# Altium schematic sheet TOP_VOLTAGE.SchDoc
size A3
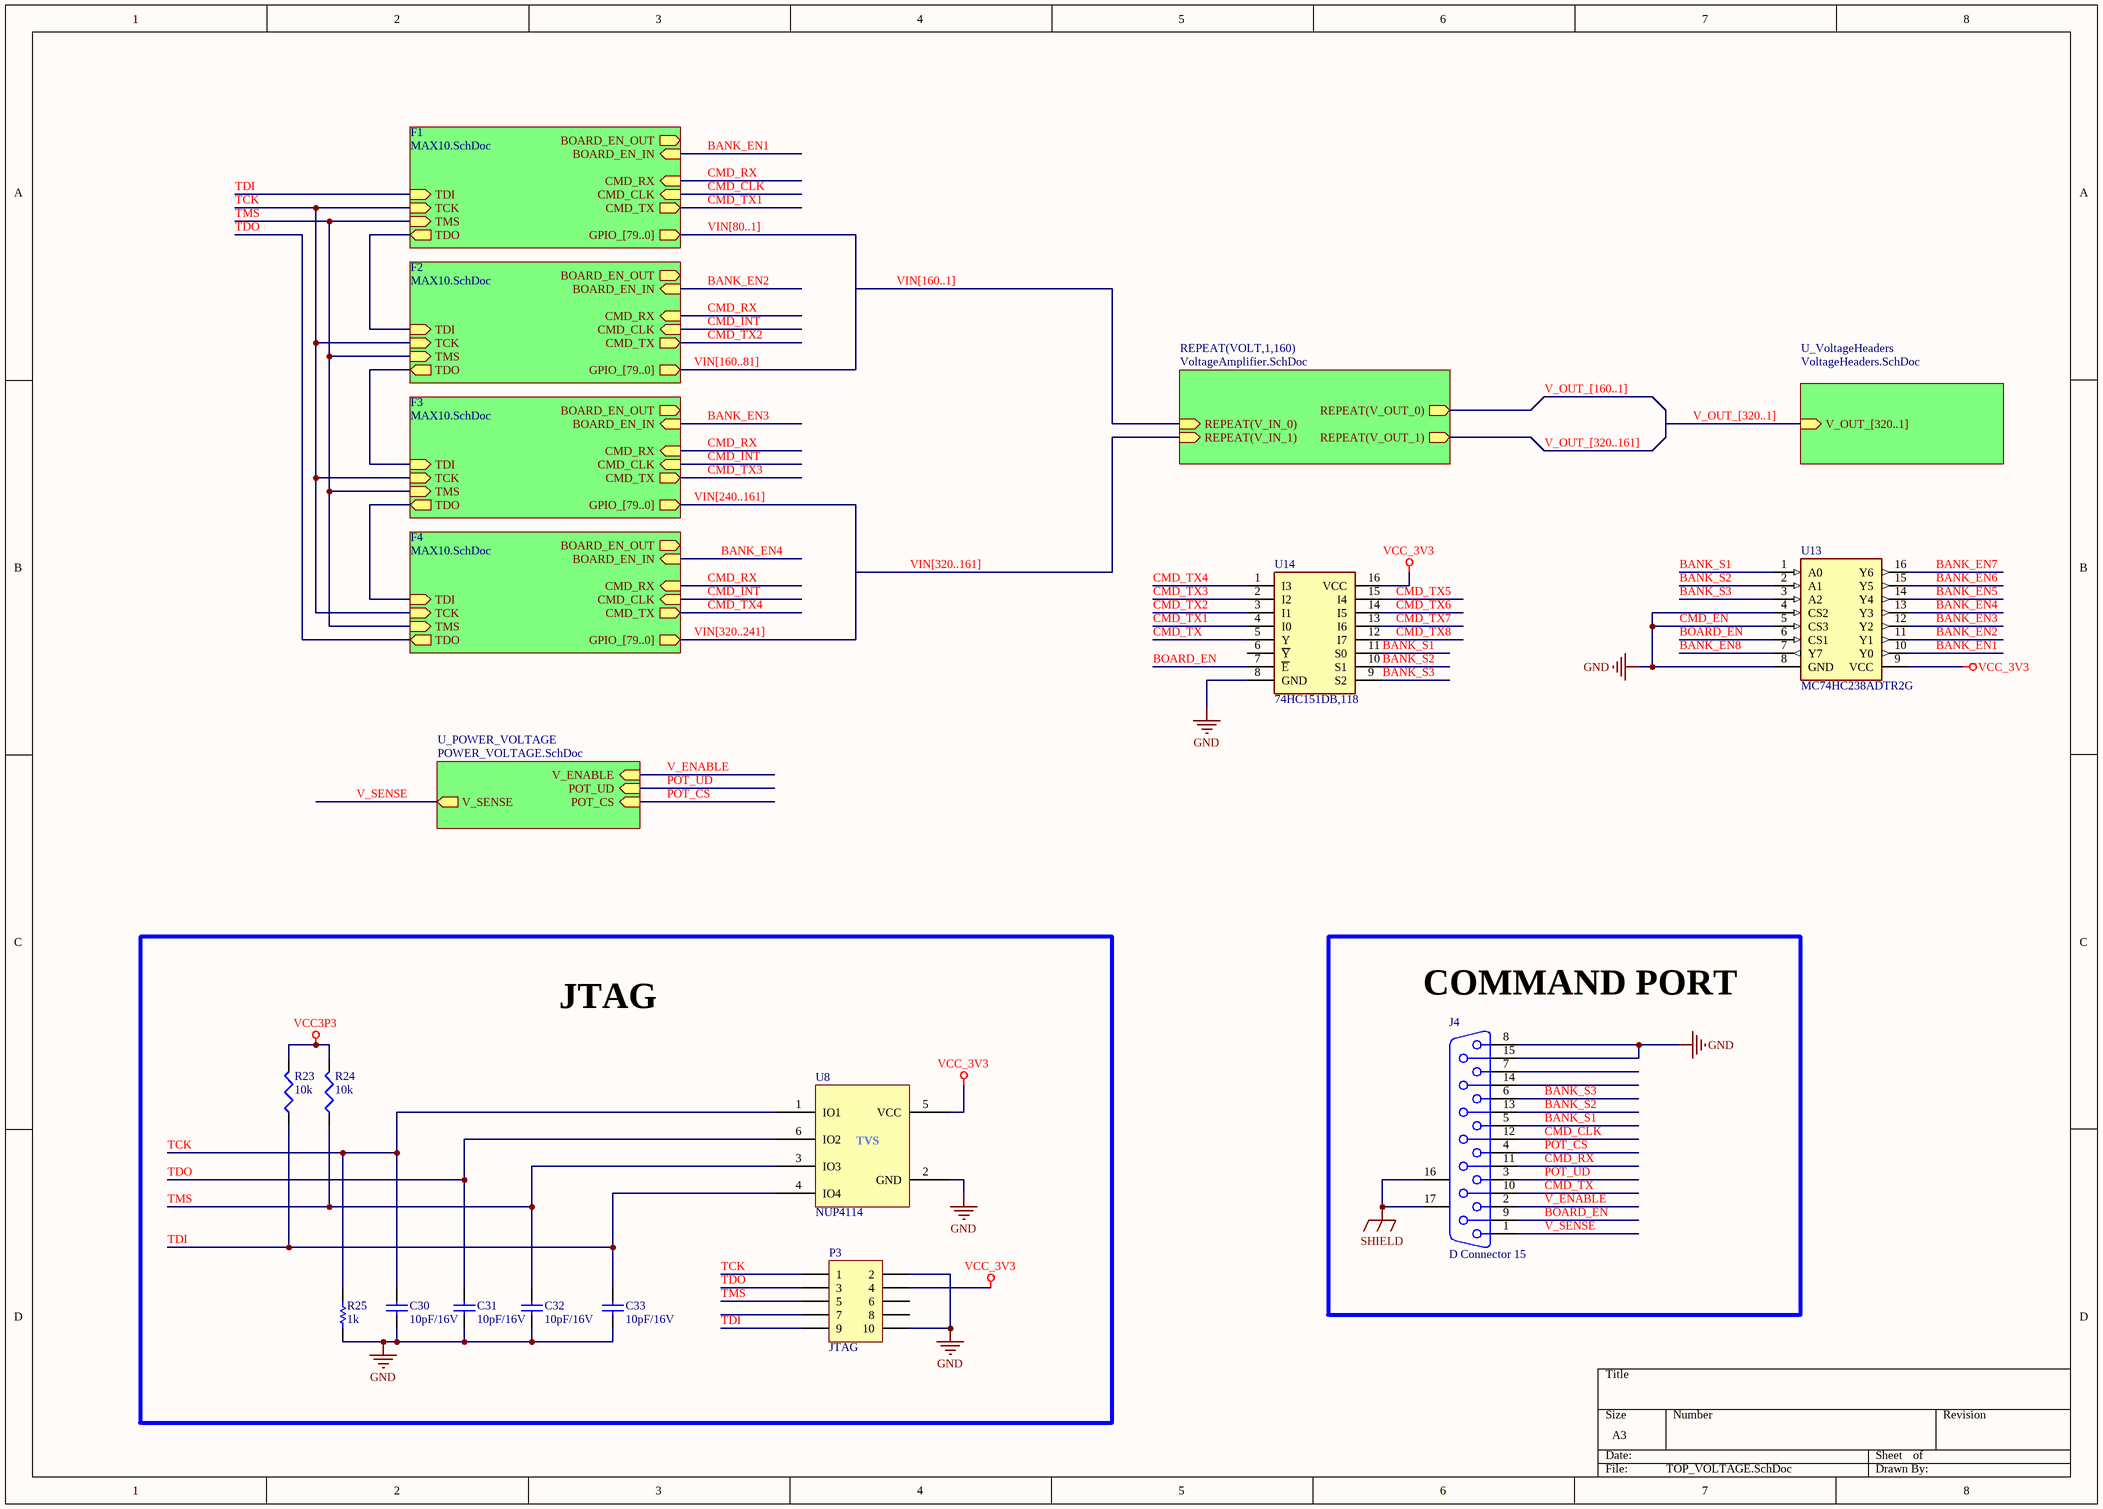
[diagram p0: TOP_VOLTAGE.SchDoc]

## Parts
C30  10pF/16V  [0603_CAP]
C31  10pF/16V  [0603_CAP]
C32  10pF/16V  [0603_CAP]
C33  10pF/16V  [0603_CAP]
J4  D Connector 15  [DSUB1.385-2H15]
P3  JTAG  [HDR2X5]
R23  10k  [0402_RES]
R24  10k  [0402_RES]
R25  1k  [RES_0805]
U8  NUP4114  [NUP4114HMR6T1G]
U13  MC74HC238ADTR2G  [SOP65P640X120-16N]
U14  74HC151DB,118  [SOP65P775X200-16N]

## Blocks framed on the sheet
JTAG: C30-C33 P3 R23-R25 U8
COMMAND PORT: J4

## Sub-sheets
F1 = MAX10.SchDoc: TDI (in), GPIO_[79..0] (out), TCK (in), TMS (in), TDO (out), CMD_RX (in), CMD_TX (out), BOARD_EN_IN (in), BOARD_EN_OUT (out), CMD_CLK (in)
F2 = MAX10.SchDoc: TDI (in), GPIO_[79..0] (out), TCK (in), TMS (in), TDO (out), CMD_TX (out), CMD_RX (in), BOARD_EN_OUT (out), BOARD_EN_IN (in), CMD_CLK (in)
F3 = MAX10.SchDoc: TDI (in), GPIO_[79..0] (out), TCK (in), TMS (in), TDO (out), CMD_TX (out), CMD_RX (in), CMD_CLK (in), BOARD_EN_IN (in), BOARD_EN_OUT (out)
F4 = MAX10.SchDoc: TDI (in), GPIO_[79..0] (out), TCK (in), TMS (in), TDO (out), CMD_TX (out), CMD_RX (in), BOARD_EN_IN (in), CMD_CLK (in), BOARD_EN_OUT (out)
REPEAT(VOLT,1,160) = VoltageAmplifier.SchDoc: REPEAT(V_IN_0) (in), REPEAT(V_OUT_0) (out), REPEAT(V_OUT_1) (out), REPEAT(V_IN_1) (in)
U_POWER_VOLTAGE = POWER_VOLTAGE.SchDoc: V_SENSE (out), V_ENABLE (in), POT_UD (in), POT_CS (in)
U_VoltageHeaders = VoltageHeaders.SchDoc: V_OUT_[320..1] (in)

## Nets
CMD_EN: C30.1 C31.1 C32.1 C33.1 J4.8 J4.15 P3.2 P3.10 R25.2 U8.2(GND) U13.4(CS2) U13.5(CS3) U13.8(GND) U14.8(GND)  [also labelled GND]
SHIELD: J4.16(MH1) J4.17(MH2)
VCC3P3: R23.2 R24.2
VCC_3V3: P3.4 U8.5(VCC) U13.9(VCC) U14.16(VCC)
BANK_EN1: U13.10(Y0) ; sheet F1/BOARD_EN_IN
BANK_EN2: U13.11(Y1) ; sheet F2/BOARD_EN_IN
BANK_EN3: U13.12(Y2) ; sheet F3/BOARD_EN_IN
BANK_EN4: U13.13(Y3) ; sheet F4/BOARD_EN_IN
BANK_EN5: U13.14(Y4)
BANK_EN6: U13.15(Y5)
BANK_EN7: U13.16(Y6)
BANK_EN8: U13.7(Y7)
BANK_S1: J4.5 U13.1(A0) U14.11(S0)
BANK_S2: J4.13 U13.2(A1) U14.10(S1)
BANK_S3: J4.6 U13.3(A2) U14.9(S2)
BOARD_EN: J4.9 U13.6(CS1) U14.7(~{E})
CMD_CLK: J4.12 ; sheet F1/CMD_CLK
CMD_INT: sheet F2/CMD_CLK, sheet F3/CMD_CLK, sheet F4/CMD_CLK
CMD_RX: J4.11 ; sheet F1/CMD_RX, sheet F2/CMD_RX, sheet F3/CMD_RX, sheet F4/CMD_RX
CMD_TX: J4.10 U14.5(Y)
CMD_TX1: U14.4(I0) ; sheet F1/CMD_TX
CMD_TX2: U14.3(I1) ; sheet F2/CMD_TX
CMD_TX3: U14.2(I2) ; sheet F3/CMD_TX
CMD_TX4: U14.1(I3) ; sheet F4/CMD_TX
CMD_TX5: U14.15(I4)
CMD_TX6: U14.14(I5)
CMD_TX7: U14.13(I6)
CMD_TX8: U14.12(I7)
POT_CS: J4.4 ; sheet U_POWER_VOLTAGE/POT_CS
POT_UD: J4.3 ; sheet U_POWER_VOLTAGE/POT_UD
TCK: C30.2 P3.1 R25.1 U8.1(IO1) ; sheet F1/TCK, sheet F2/TCK, sheet F3/TCK, sheet F4/TCK
TDI: C33.2 P3.9 R23.1 U8.4(IO4) ; sheet F1/TDI
TDO: C31.2 P3.3 U8.6(IO2) ; sheet F4/TDO
TMS: C32.2 P3.5 R24.1 U8.3(IO3) ; sheet F1/TMS, sheet F2/TMS, sheet F3/TMS, sheet F4/TMS
V_ENABLE: J4.2 ; sheet U_POWER_VOLTAGE/V_ENABLE
V_OUT_[160..1]: sheet REPEAT(VOLT,1,160)/REPEAT(V_OUT_0)
V_OUT_[320..161]: sheet REPEAT(VOLT,1,160)/REPEAT(V_OUT_1)
V_SENSE: J4.1 ; sheet U_POWER_VOLTAGE/V_SENSE
(unnamed): sheet F1/TDO, sheet F2/TDI
(unnamed): sheet F2/TDO, sheet F3/TDI
(unnamed): sheet F3/TDO, sheet F4/TDI

Not connected (* = marked no-connect by the designer): J4 7 14; P3 6 7 8; U14 6(~{Y})

## Buses and harness runs
bus V_OUT_[320..1] = sheet U_VoltageHeaders/V_OUT_[320..1]
bus VIN[80..1] = VIN[160..1] = VIN[160..81] = sheet F1/GPIO_[79..0] = sheet F2/GPIO_[79..0]
bus VIN[240..161] = VIN[320..161] = VIN[320..241] = sheet F3/GPIO_[79..0] = sheet F4/GPIO_[79..0]

## Notes on the sheet
- (in symbol NUP4114) TVS

## Library data of the parts
C30-C33 = Cap: Multilayer Ceramic Capacitors MLCC - SMD/SMT 16V 10pF 0603 X7R 0.1; Mfr Part No: C0603C100K4RACTU; Manufacturer: KEMET; Value: 10pF/16V; Stockiest: MOUSER; Stockiest Part No: 80-C0603C100K4RACTU; Package: 0603; Price: 0.1
J4 = D Connector 15: Receptacle Assembly, 15 Position, Right Angle; PackageDocument: O; Positions: 15; Published: 15-Jun-2001; LatestRevisionDate: 17-Jul-2002; LatestRevisionNote: Re-released for DXP Platform.; DatasheetDocument: 1-Sep-99; PackageReference: 788757; Publisher: Altium Limited; Orientation: Right Angle; Gender: Receptacle
P3 = Header 5X2: Header, 5-Pin, Dual row; LatestRevisionDate: 17-Jul-2002; LatestRevisionNote: Re-released for DXP Platform.; Publisher: Altium Limited
R23 R24 = 0402_RES: Thick Film Resistors - SMD 10K OHM 1%; Manufacturer: Yageo; Mfr Part No: RC0402FR-0710KL; Package: 0402; Price: 0.1; Stockiest Part No: 603-RC0402FR-0710KL; Value: 10k; Stockiest: MOUSER
R25 = Res1: Thick Film Resistors - SMD 1/16W 1K Ohm 50V 1% ANTI SULFUR AEC-Q200; Mfr Part No: AA0402FR-071KL; Manufacturer: Yageo; Value: 1k; Stockiest: MOUSER; Stockiest Part No: 603-AA0402FR-071KL; Package: 0402; Price: 0.1
U8 = NUP4114: ESD Suppressors / TVS Diodes LOW CAP TVS ARRAY 5.5V; Manufacturer: ON Semi; Mfr Part No: NUP4114HMR6T1G; Package: SMD; Price: 0.529; Stockiest: MOUSER; Stockiest Part No: 863-NUP4114HMR6T1G; Value: 5.5V
U13 = MC74HC238ADTR2G: Integrated Circuit; Manufacturer_Name: ON Semiconductor; Datasheet Link: https://componentsearchengine.com/Datasheets/2/MC74HC238ADTR2G.pdf; Height: 1.2mm; Manufacturer_Part_Number: MC74HC238ADTR2G; Arrow Part Number: MC74HC238ADTR2G; Arrow Price/Stock: https://www.arrow.com/en/products/mc74hc238adtr2g/on-semiconductor; Mouser Part Number: 863-MC74HC238ADTR2G; Mouser Price/Stock: https://www.mouser.co.uk/ProductDetail/ON-Semiconductor/MC74HC238ADTR2G?qs=mB5q98eOMcYIHVTp70gNug%3D%3D
U14 = 74HC151DB,118: Integrated Circuit; Manufacturer_Name: Nexperia; Datasheet Link: https://assets.nexperia.com/documents/data-sheet/74HC_HCT151.pdf; Height: 2mm; Manufacturer_Part_Number: 74HC151DB,118; Arrow Part Number: 74HC151DB,118; Arrow Price/Stock: https://www.arrow.com/en/products/74hc151db118/nexperia; Mouser Part Number: 771-HC151DB118; Mouser Price/Stock: https://www.mouser.co.uk/ProductDetail/Nexperia/74HC151DB118?qs=P62ublwmbi%252BDFn2LoumROw%3D%3D